# EAGLE design Sony_keyboard (EAGLE 9.2.2)
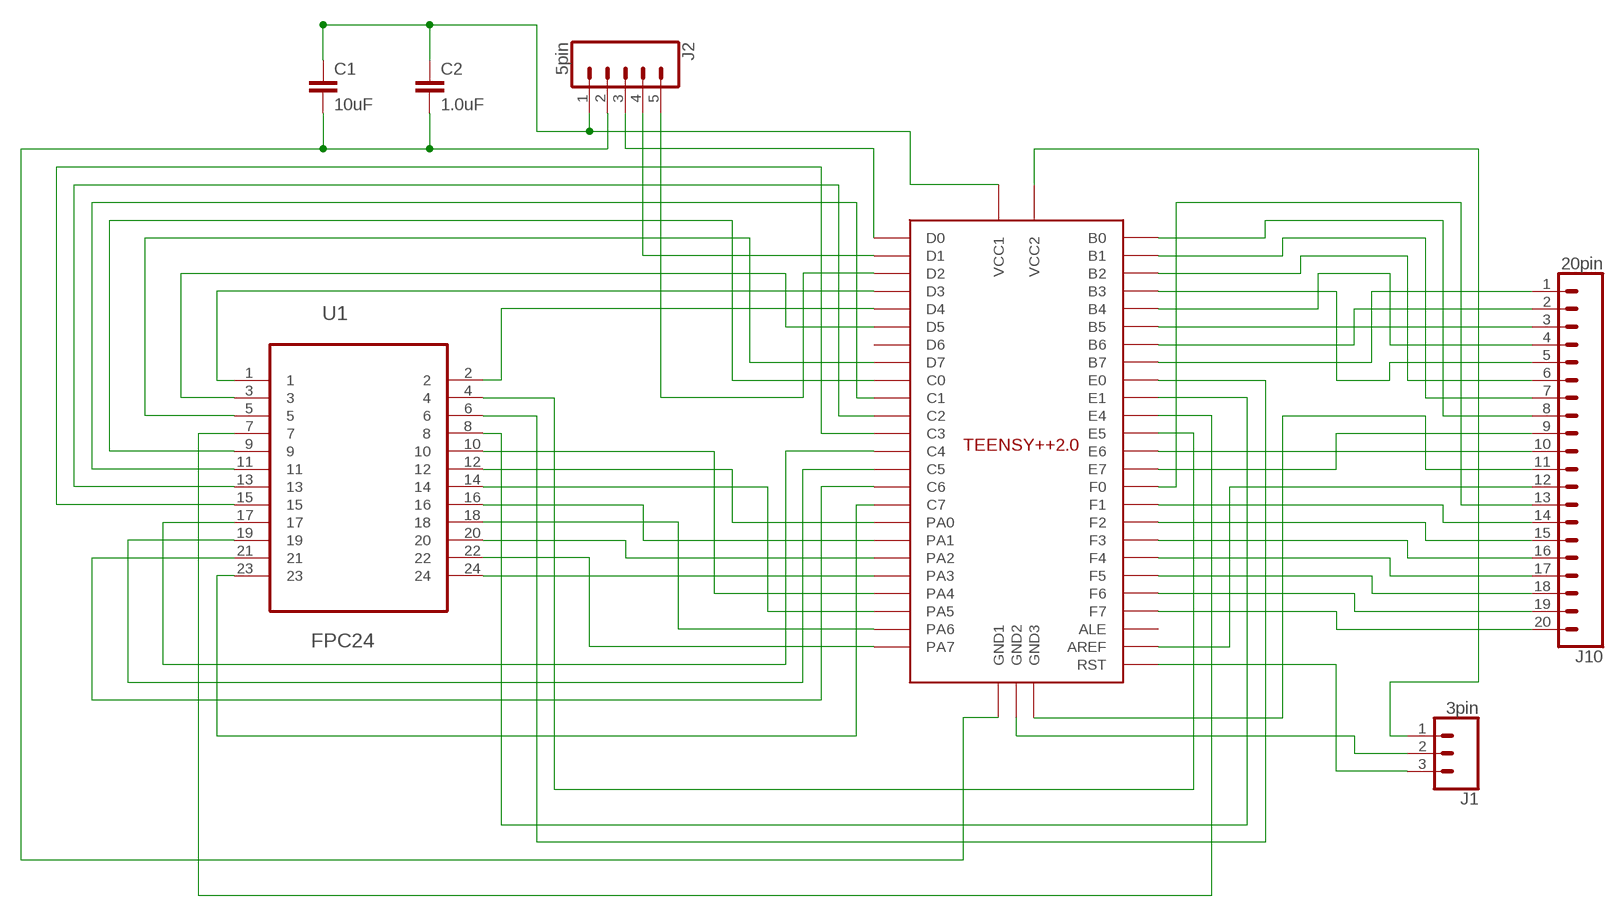
[diagram p0: schematic, sheet 1]

## Parts
C1  10uF  10UF-0603-6.3V-20%  [0603]
C2  1.0uF  1.0UF-0603-16V-10%  [0603]
J1  3pin  CONN_03  [1X03]
J2  5pin  CONN_05  [1X05]
J10  20pin  CONN_20  [1X20]
U1  FPC24  [FPC24]
U2  Teensy++2.0  TEENSYPP2.0  [TEENSYPP2.0]

## Nets
N$1: U1.22 U2.PA7
N$2: U1.18 U2.PA6
N$3: U1.14 U2.PA5
N$4: U1.10 U2.PA4
N$5: U1.24 U2.PA3
N$6: U1.20 U2.PA2
N$7: U1.16 U2.PA1
N$8: U1.12 U2.PA0
N$9: U1.6 U2.E0
N$10: U1.8 U2.E1
N$11: U1.7 U2.E4
N$12: U1.4 U2.E5
N$13: U1.1 U2.D3
N$14: U1.2 U2.D4
N$15: U1.3 U2.D5
N$16: U1.5 U2.D7
N$17: U1.9 U2.C0
N$18: U1.11 U2.C1
N$19: U1.13 U2.C2
N$20: U1.15 U2.C3
N$21: U1.17 U2.C4
N$22: U1.19 U2.C5
N$23: U1.21 U2.C6
N$24: U1.23 U2.C7
N$25: J10.18 U2.F5
N$26: J2.5 U2.D2
N$27: J2.4 U2.D1
N$28: J2.3 U2.D0
N$29: J10.1 U2.B7
N$30: J10.2 U2.B6
N$31: J10.3 U2.B5
N$32: J10.4 U2.B4
N$33: J10.5 U2.B3
N$34: J10.6 U2.B2
N$35: J10.7 U2.B1
N$36: J10.8 U2.B0
N$37: J10.9 U2.E7
N$38: J10.10 U2.E6
N$39: J10.12 U2.AREF
N$40: J10.13 U2.F0
N$41: J10.14 U2.F1
N$42: J10.15 U2.F2
N$43: J10.16 U2.F3
N$44: J10.17 U2.F4
N$46: J10.19 U2.F6
N$47: J10.20 U2.F7
N$48: J1.3 U2.RST
N$49: C1.1 C2.1 J2.1 U2.VCC1
N$50: J1.1 U2.VCC2
N$53: J10.11 U2.GND3
N$54: J1.2 U2.GND2
N$55: C1.2 C2.2 J2.2 U2.GND1
Unconnected: U2.ALE U2.D6

## Library data of the parts
C1 = SparkFun-Capacitors:10UF: 10.0µF ceramic capacitors A capacitor is a passive two-terminal electrical component used to store electrical energy temporarily in an electric field.; PROD_ID: CAP-11015
C2 = SparkFun-Capacitors:1.0UF: 1µF ceramic capacitors A capacitor is a passive two-terminal electrical component used to store electrical energy temporarily in an electric field.; PROD_ID: CAP-00868
J1 = SparkFun-Connectors:CONN_03: Multi connection point. Often used as Generic Header-pin footprint for 0.1 inch spaced/style header connections On any of the 0.1 inch spaced packages, you can populate with these: Break Away Headers - Straight <https://www.sparkfun.com/products/116> (PRT-00116) Break Away Male Headers - Right Angle <https://www.sparkfun.com/products/553> (PRT-00553) Female Headers <https://www.sparkfun.com/products/115> (PRT-00115) Break Away Headers - Machine Pin <https://www.sparkfun.com/products/117> (PRT-00117) Break Away Female Headers - Swiss Machine Pin <https://www.sparkfun.com/products/743> (PRT-00743) Stackable Header - 3 Pin (Female, 0.1") <https://www.sparkfun.com/products/13875> (PRT-13875) For SCREWTERMINALS and SPRING TERMINALS visit here: Screw Terimnals on SparkFun.com <https://www.sparkfun.com/search/results?term=Screw+Terminals> (5mm/3.5mm/2.54mm spacing) This device is also useful as a general connection point to wire up your design to another part of your project. Our various solder wires solder well into these plated through hole pads. Hook-Up Wire - Assortment (Stranded, 22 AWG) <https://www.sparkfun.com/products/11375> (PRT-11375) Hook-Up Wire - Assortment (Solid Core, 22 AWG) <https://www.sparkfun.com/products/11367> (PRT-11367) View the entire wire category on our website here <https://www.sparkfun.com/categories/141> Special notes: Molex polarized connector foot print use with SKU : PRT-08232 with associated crimp pins and housings.
J2 = SparkFun-Connectors:CONN_05: Multi connection point. Often used as Generic Header-pin footprint for 0.1 inch spaced/style header connections On any of the 0.1 inch spaced packages, you can populate with these: Break Away Headers - Straight <https://www.sparkfun.com/products/116> (PRT-00116) Break Away Male Headers - Right Angle <https://www.sparkfun.com/products/553> (PRT-00553) Female Headers <https://www.sparkfun.com/products/115> (PRT-00115) Break Away Headers - Machine Pin <https://www.sparkfun.com/products/117> (PRT-00117) Break Away Female Headers - Swiss Machine Pin <https://www.sparkfun.com/products/743> (PRT-00743) For SCREWTERMINALS and SPRING TERMINALS visit here: Screw Terimnals on SparkFun.com <https://www.sparkfun.com/search/results?term=Screw+Terminals> (5mm/3.5mm/2.54mm spacing) This device is also useful as a general connection point to wire up your design to another part of your project. Our various solder wires solder well into these plated through hole pads. Hook-Up Wire - Assortment (Stranded, 22 AWG) <https://www.sparkfun.com/products/11375> (PRT-11375) Hook-Up Wire - Assortment (Solid Core, 22 AWG) <https://www.sparkfun.com/products/11367> (PRT-11367) View the entire wire category on our website here <https://www.sparkfun.com/categories/141> Special notes: Molex polarized connector foot print use with SKU : PRT-08231 with associated crimp pins and housings. 1MM SMD Version SKU: PRT-10208
J10 = SparkFun-Connectors:CONN_20: Multi connection point. Often used as Generic Header-pin footprint for 0.1 inch spaced/style header connections On any of the 0.1 inch spaced packages, you can populate with these: Break Away Headers - Straight <https://www.sparkfun.com/products/116> (PRT-00116) Break Away Male Headers - Right Angle <https://www.sparkfun.com/products/553> (PRT-00553) Female Headers <https://www.sparkfun.com/products/115> (PRT-00115) Break Away Headers - Machine Pin <https://www.sparkfun.com/products/117> (PRT-00117) Break Away Female Headers - Swiss Machine Pin <https://www.sparkfun.com/products/743> (PRT-00743) For SCREWTERMINALS and SPRING TERMINALS visit here: Screw Terimnals on SparkFun.com <https://www.sparkfun.com/search/results?term=Screw+Terminals> (5mm/3.5mm/2.54mm spacing) This device is also useful as a general connection point to wire up your design to another part of your project. Our various solder wires solder well into these plated through hole pads. Hook-Up Wire - Assortment (Stranded, 22 AWG) <https://www.sparkfun.com/products/11375> (PRT-11375) Hook-Up Wire - Assortment (Solid Core, 22 AWG) <https://www.sparkfun.com/products/11367> (PRT-11367) View the entire wire category on our website here <https://www.sparkfun.com/categories/141> Special notes: Molex polarized connector foot print use with SKU : PRT-08231 with associated crimp pins and housings. 1MM SMD Version SKU: PRT-10208 NOTES ON THE VARIANTS LOCK and LOCK_LONGPADS... This footprint was designed to help hold the alignment of a through-hole component (i.e. 6-pin header) while soldering it into place. You may notice that each hole has been shifted either up or down by 0.005 of an inch from it's more standard position (which is a perfectly straight line). This slight alteration caused the pins (the squares in the middle) to touch the edges of the holes. Because they are alternating, it causes a "brace" to hold the component in place. 0.005 has proven to be the perfect amount of "off-center" position when using our standard breakaway headers. Although looks a little odd when you look at the bare footprint, once you have a header in there, the alteration is very hard to notice. Also,if you push a header all the way into place, it is covered up entirely on the bottom side. Note about LOCK SPECIAL package: This is just like the LOCK variant in that the holes are staggared by 5 mil, but except for the last two holes. They are not altered from the "standard" footprint layout. This is used for a special purpose on the layout of our Graphic LCD Backpack. Make sure you want to use this device before selecting it for you project!
U1 = FPC CONN:FPC24: CONNECTOR, FPC, 1.0MM, 24 pin
U2 = Teensy:TEENSYPP2.0

## Board
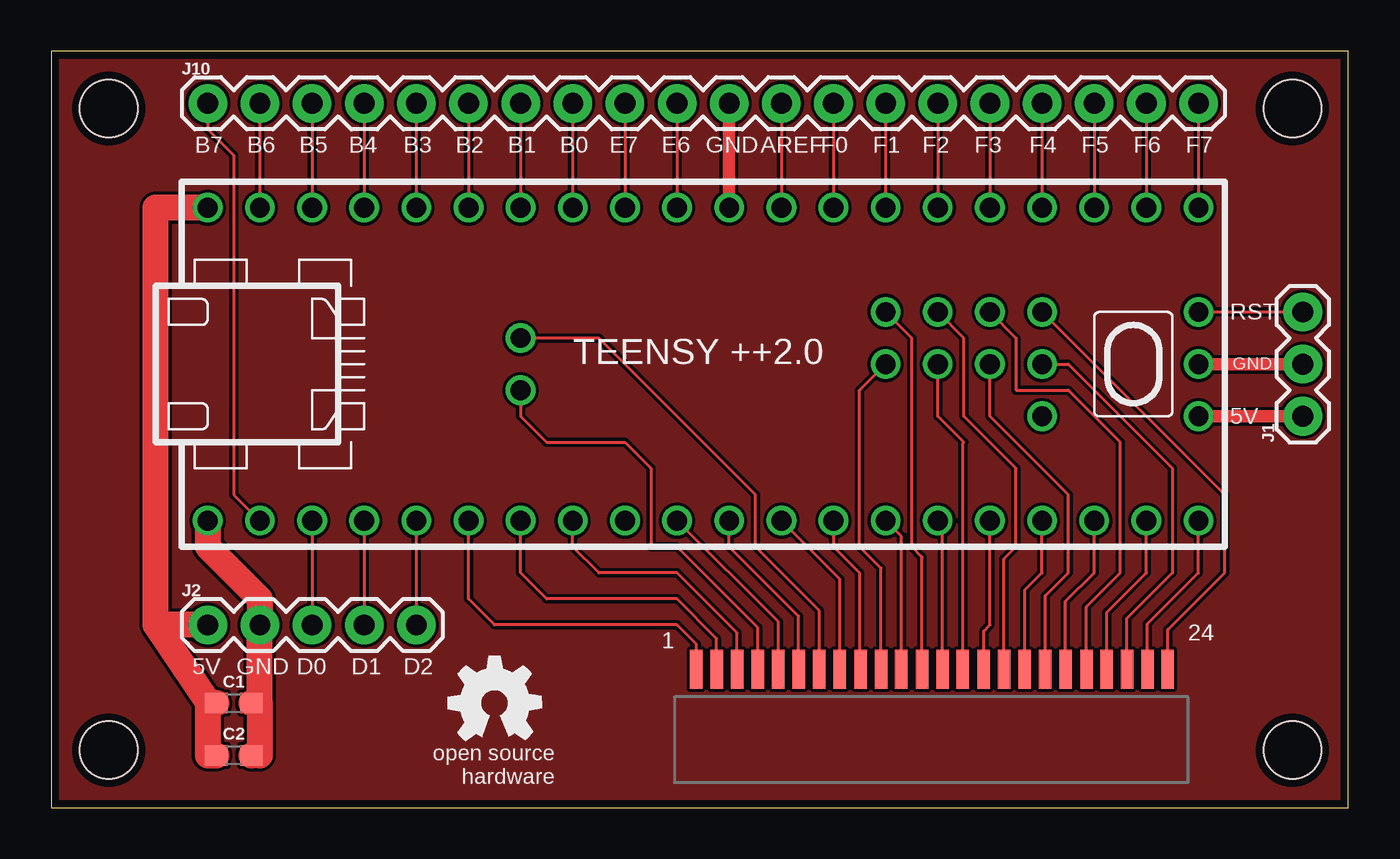
[diagram p1: board, top side]
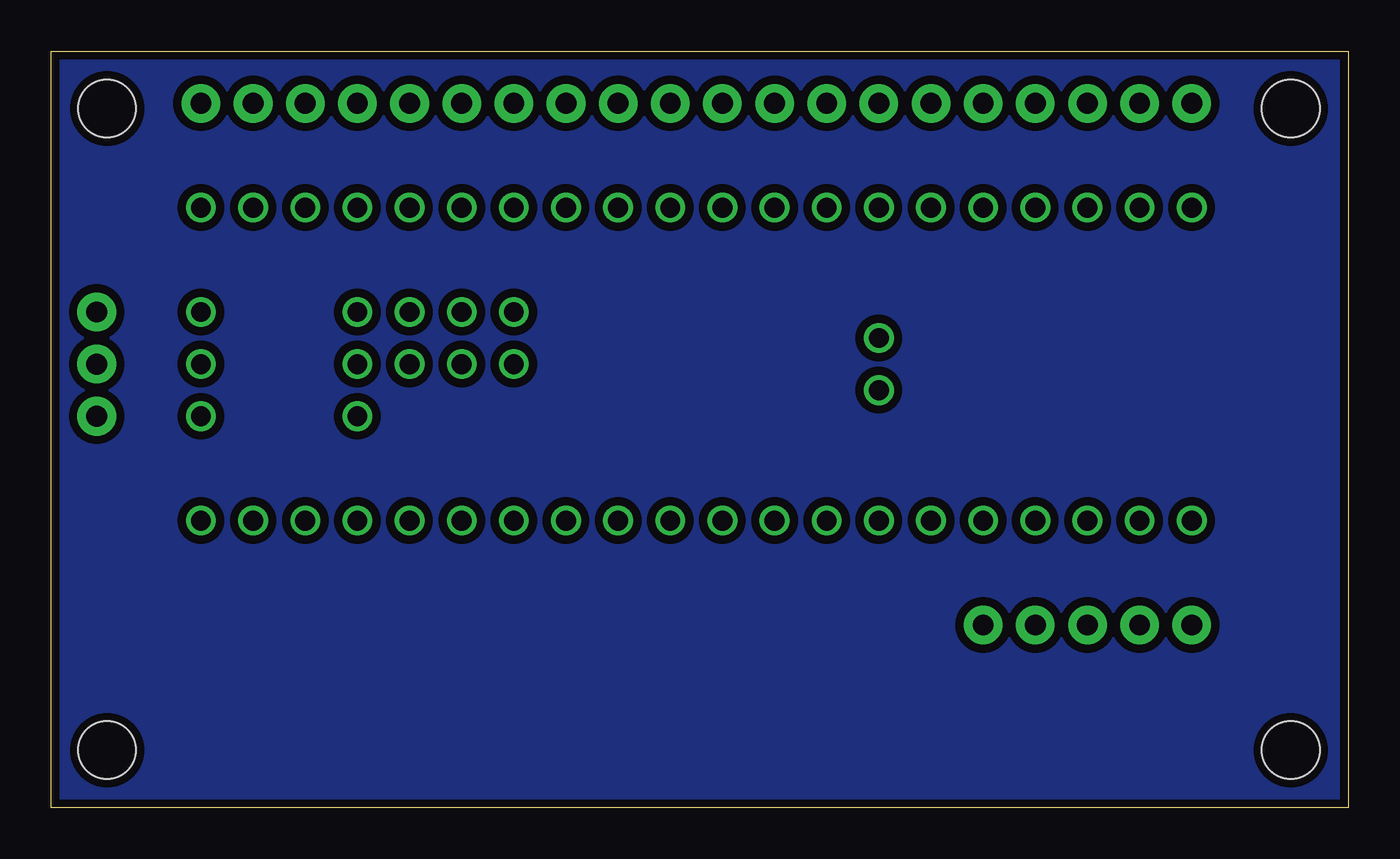
[diagram p2: board, bottom side, seen from below]

Size 63.17 x 36.82 mm. Coordinates in mm from the lower left corner, seen from the top.
Outline: 0,0 63.17,0 63.17,36.82 0,36.82 0,0
Copper layers (1*16): Top 0.035559375mm / dielectric 1.6mm / Bottom 0.035559375mm
Design rules "oshpark-2layer": minimum track width 6mil, minimum drill 10mil, track to track 6mil, track to pad 6mil, pad to pad 6mil, via to via 6mil, smd to smd 6mil, copper to edge 15mil, drill to drill 6mil, minimum pad ring 5mil, minimum via ring 5mil, stop-mask expansion 2.5mil, vias tented up to drill 0mil, thermal gap 10mil
Holes 2.8 mm at 2.79,34.04 2.79,2.79 60.45,2.79 60.45,34.04

### Footprints (pad centres in the part's own frame; a part is rotated, then mirrored left to right if it is on the bottom)
0603 = smd 1.1 x 1: 1 -0.85,0; 2 0.85,0
1X03 = drill 1.016 pad 1.88: 1 0,0; 2 2.54,0; 3 5.08,0
1X05 = drill 1.016 pad 1.88: 1 0,0; 2 2.54,0; 3 5.08,0; 4 7.62,0; 5 10.16,0
1X20 = drill 1.016 pad 1.88: 1 0,0; 2 2.54,0; 3 5.08,0; 4 7.62,0; 5 10.16,0; 6 12.7,0; 7 15.24,0; 8 17.78,0; 9 20.32,0; 10 22.86,0; 11 25.4,0; 12 27.94,0; 13 30.48,0; 14 33.02,0; 15 35.56,0; 16 38.1,0; 17 40.64,0; 18 43.18,0; 19 45.72,0; 20 48.26,0
FPC24 = smd 0.61 x 1.905: 1 10.49,-4.191; 2 9.5,-4.191; 3 8.509,-4.191; 4 7.493,-4.191; 5 6.502,-4.191; 6 5.512,-4.191; 7 4.496,-4.191; 8 3.505,-4.191; 9 2.489,-4.191; 10 1.499,-4.191; 11 0.508,-4.191; 12 -0.508,-4.191; 13 -1.499,-4.191; 14 -2.489,-4.191; 15 -3.505,-4.191; 16 -4.496,-4.191; 17 -5.512,-4.191; 18 -6.502,-4.191; 19 -7.493,-4.191; 20 -8.509,-4.191; 21 -9.5,-4.191; 22 -10.49,-4.191; 23 -11.481,-4.191; 24 -12.471,-4.191
TEENSYPP2.0 = drill 0.965: ALE 16.51,-2.54; AREF 3.81,7.62; B0 -6.35,7.62; B1 -8.89,7.62; B2 -11.43,7.62; B3 -13.97,7.62; B4 -16.51,7.62; B5 -19.05,7.62; B6 -21.59,7.62; B7 -21.59,-7.62; C0 6.35,-7.62; C1 8.89,-7.62; C2 11.43,-7.62; C3 13.97,-7.62; C4 16.51,-7.62; C5 19.05,-7.62; C6 21.59,-7.62; C7 24.13,-7.62; D0 -19.05,-7.62; D1 -16.51,-7.62; D2 -13.97,-7.62; D3 -11.43,-7.62; D4 -8.89,-7.62; D5 -6.35,-7.62; D6 -3.81,-7.62; D7 -1.27,-7.62; E0 1.27,-7.62; E1 3.81,-7.62; E4 -8.89,1.27; E5 -8.89,-1.27; E6 -1.27,7.62; E7 -3.81,7.62; F0 6.35,7.62; F1 8.89,7.62; F2 11.43,7.62; F3 13.97,7.62; F4 16.51,7.62; F5 19.05,7.62; F6 21.59,7.62; F7 24.13,7.62; GND1 -24.13,-7.62; GND2 24.13,0; GND3 1.27,7.62; PA0 8.89,2.54; PA1 11.43,2.54; PA2 13.97,2.54; PA3 16.51,2.54; PA4 8.89,0; PA5 11.43,0; PA6 13.97,0; PA7 16.51,0; RST 24.13,2.54; VCC1 -24.13,7.62; VCC2 24.13,-2.54

### Placement (x,y rotation side)
C1  8.89,5.08 0 top
C2  8.89,2.54 0 top
J1  60.96,19.05 90 top
J2  7.62,8.89 0 top
J10  7.62,34.29 0 top
U1  41.91,2.54 180 top
U2  31.75,21.59 0 top
U$1  [OSHW_5MM]  21.59,5.08 0 top

### Tracks (layer width: path | path; a pad name or v marks a point on that pad's centre or on a via)
GND1
  pour Top: 0,36.83 63.5,36.83 63.5,0 0,0
N$1
  Top 0.152: U1.22 52.4,9.22 54.61,11.43 54.61,16.51 49.53,21.59 U2.PA7
N$2
  Top 0.152: U1.18 48.41,10.31 49.53,11.43 49.53,15.24 45.72,19.05 U2.PA6
N$3
  Top 0.152: U1.14 44.4,17.73 44.45,17.78 43.18,19.05 U2.PA5
N$4
  Top 0.152: U1.10 40.41,11.66 39.37,12.7 39.37,20.32 U2.PA4
N$5
  Top 0.152: U2.PA3 57.15,15.24 57.15,11.43 54.38,8.66 U1.24
N$6
  Top 0.152: U2.PA2 46.99,22.86 46.99,20.32 49.53,20.32 52.07,17.78 52.07,11.43 50.42,9.78 U1.20
N$7
  Top 0.152: U1.16 46.41,12.12 46.99,12.7 46.99,16.51 44.45,19.05 44.45,22.86 U2.PA1
N$8
  Top 0.152: U1.12 42.42,12.19 41.91,12.7 41.91,22.86 U2.PA0
N$9
  Top 0.152: U1.6 36.4,9.32 33.02,12.7 U2.E0
N$10
  Top 0.152: U1.8 38.41,11.12 U2.E1
N$11
  Top 0.152: U1.7 37.41,9.58 34.29,12.7 34.29,15.24 26.67,22.86 U2.E4
N$12
  Top 0.152: U2.E5 22.86,19.05 24.13,17.78 27.94,17.78 29.21,16.51 29.21,12.7 30.48,12.7 34.42,8.76 U1.4
N$13
  Top 0.152: U1.1 31.42,7.95 30.48,8.89 21.59,8.89 20.32,10.16 U2.D3
N$14
  Top 0.152: U1.2 32.41,8.23 30.48,10.16 24.13,10.16 22.86,11.43 U2.D4
N$15
  Top 0.152: U1.3 33.4,8.51 30.48,11.43 26.67,11.43 25.4,12.7 U2.D5
N$16
  Top 0.152: U1.5 35.41,9.04 U2.D7
N$17
  Top 0.152: U2.C0 38.1,12.7 39.37,11.43 39.37,6.78 U1.9
N$18
  Top 0.152: U1.11 41.4,13.21 U2.C1
N$19
  Top 0.152: U1.13 43.41,13.74 U2.C2
N$20
  Top 0.152: U2.C3 45.72,8.89 45.41,8.59 U1.15
N$21
  Top 0.152: U1.17 47.42,10.59 48.26,11.43 U2.C4
N$22
  Top 0.152: U1.19 49.4,10.03 50.8,11.43 U2.C5
N$23
  Top 0.152: U1.21 51.41,9.5 53.34,11.43 U2.C6
N$24
  Top 0.152: U2.C7 55.88,11.43 53.39,8.94 U1.23
N$25
  Top 0.152: J10.18 U2.F5
N$26
  Top 0.152: U2.D2 J2.5
N$27
  Top 0.152: U2.D1 J2.4
N$28
  Top 0.152: U2.D0 J2.3
N$29
  Top 0.152: J10.1 7.62,33.02 8.89,31.75 8.89,15.24 U2.B7
N$30
  Top 0.152: J10.2 U2.B6
N$31
  Top 0.152: J10.3 U2.B5
N$32
  Top 0.152: J10.4 U2.B4
N$33
  Top 0.152: J10.5 U2.B3
N$34
  Top 0.152: J10.6 U2.B2
N$35
  Top 0.152: J10.7 U2.B1
N$36
  Top 0.152: J10.8 U2.B0
N$37
  Top 0.152: J10.9 U2.E7
N$38
  Top 0.152: J10.10 U2.E6
N$39
  Top 0.152: J10.12 U2.AREF
N$40
  Top 0.152: J10.13 U2.F0
N$41
  Top 0.152: J10.14 U2.F1
N$42
  Top 0.152: J10.15 U2.F2
N$43
  Top 0.152: J10.16 U2.F3
N$44
  Top 0.152: J10.17 U2.F4
N$45
  pour Bottom (isolate 0.406): 0,36.83 63.5,36.83 63.5,0 0,0
N$46
  Top 0.152: J10.19 U2.F6
N$47
  Top 0.152: J10.20 U2.F7
N$48
  Top 0.152: U2.RST J1.3
N$49
  Top 1.27: U2.VCC1 5.08,29.21 5.08,8.89 | 5.08,8.89 7.62,5.14 | 7.62,5.14 7.62,2.54 C2.1 | C1.1 7.68,5.08 7.62,5.14 | J2.1 5.08,8.89
N$50
  Top 0.61: U2.VCC2 J1.1
N$53
  Top 0.61: U2.GND3 J10.11
N$54
  Top 0.61: U2.GND2 J1.2
N$55
  Top 1.27: U2.GND1 7.62,12.7 10.16,10.16 J2.2 10.16,5.06 | 10.16,5.06 10.16,2.54 C2.2 | C1.2 10.14,5.08 10.16,5.06

### Text on the board
tPlace: B7 | B6 | B5 | B4 | B3 | B2 | B1 | B0 | E7 | E6 | GND | AREF | F0 | F1 | F2 | F3 | F4 | F5 | F6 | F7 | RST | GND | 5V | 1 | 24 | 5V | GND | D0 | D1 | D2